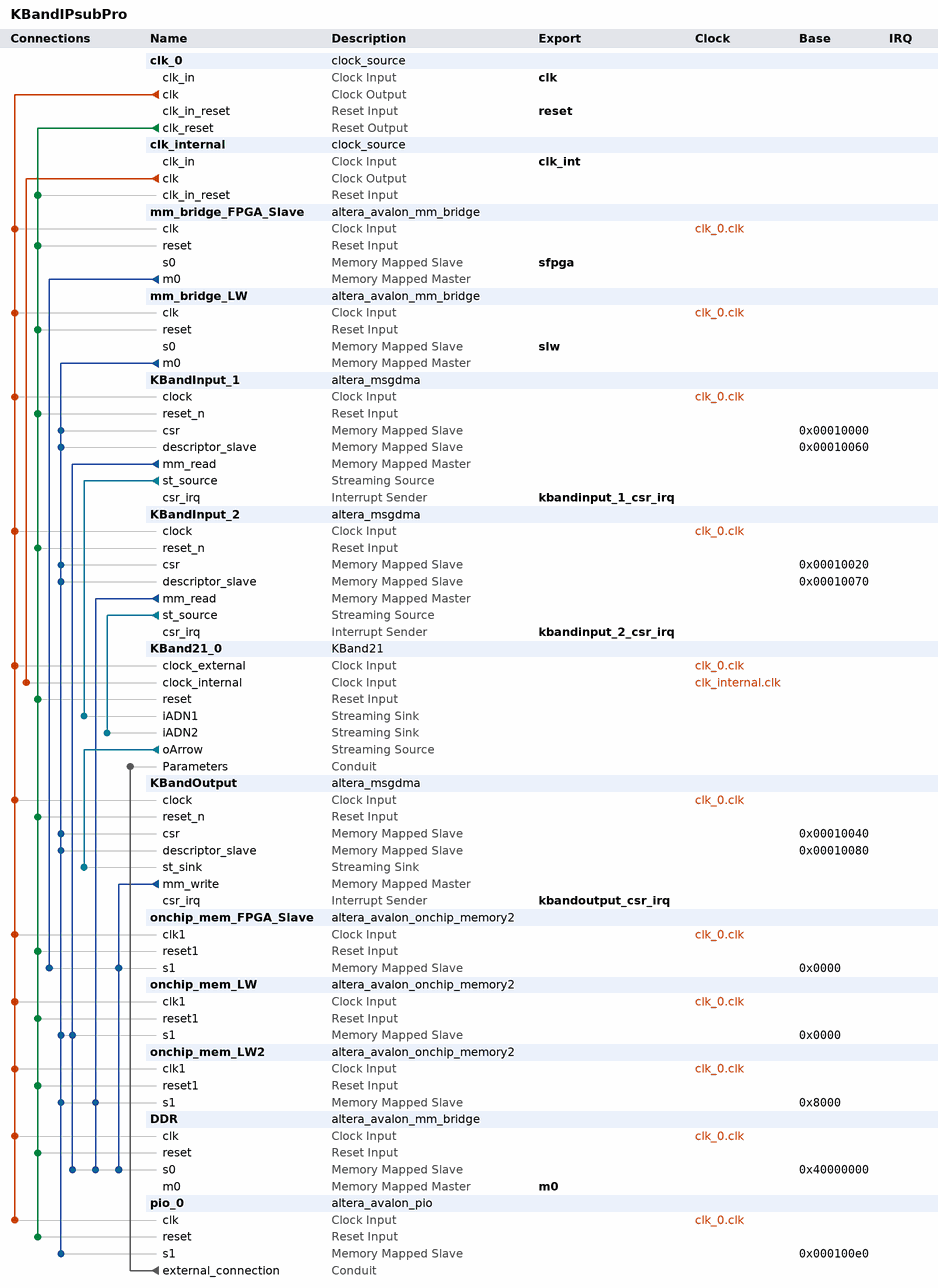
[diagram p0: system contents]
# Platform Designer (Qsys) system KBandIPsubPro, Stratix 10 1SG280HU2F50E2VG
# Parameters at their usual value, and those the tool derives, are not listed.
package require -exact qsys 1.0
create_system KBandIPsubPro
set_project_property DEVICE_FAMILY {Stratix 10}
set_project_property DEVICE 1SG280HU2F50E2VG

add_component clk_0 ip/KBandIPsubPro/KBandIPsubPro_clk_0.ip clock_source clk_0 

add_component clk_internal ip/KBandIPsubPro/KBandIPsubPro_clk_internal.ip clock_source clk_internal 

add_component mm_bridge_FPGA_Slave ip/KBandIPsubPro/KBandIPsubPro_mm_bridge_FPGA_Slave.ip altera_avalon_mm_bridge mm_bridge_FPGA_Slave 19.1
load_component mm_bridge_FPGA_Slave
set_component_parameter_value DATA_WIDTH 64
set_component_parameter_value ADDRESS_WIDTH 18
set_component_parameter_value USE_AUTO_ADDRESS_WIDTH 0
set_component_parameter_value ADDRESS_UNITS SYMBOLS
set_component_parameter_value MAX_PENDING_RESPONSES 4
set_component_parameter_value SYNC_RESET 0
save_component

add_component mm_bridge_LW ip/KBandIPsubPro/KBandIPsubPro_mm_bridge_LW.ip altera_avalon_mm_bridge mm_bridge_LW 19.1

add_component KBandInput_1 ip/KBandIPsubPro/KBandIPsubPro_KBandInput_1.ip altera_msgdma KBandInput_1 19.1

add_component KBandInput_2 ip/KBandIPsubPro/KBandIPsubPro_KBandInput_2.ip altera_msgdma KBandInput_2 19.1

add_component KBand21_0 ip/KBandIPsubPro/KBandIPsubPro_KBand21_0.ip KBand21 KBand21_0 1.0

add_component KBandOutput ip/KBandIPsubPro/KBandIPsubPro_KBandOutput.ip altera_msgdma KBandOutput 19.1
load_component KBandOutput
set_component_parameter_value MODE 2
set_component_parameter_value DATA_WIDTH 128
set_component_parameter_value DATA_FIFO_DEPTH 32
set_component_parameter_value DESCRIPTOR_FIFO_DEPTH 128
set_component_parameter_value MAX_BYTE 524288
set_component_parameter_value TRANSFER_TYPE {Aligned Accesses}
set_component_parameter_value NO_BYTEENABLES 0
set_component_parameter_value BURST_ENABLE 0
set_component_parameter_value MAX_BURST_COUNT 2
set_component_parameter_value WRITE_RESPONSE_ENABLE 0
set_component_parameter_value ENHANCED_FEATURES 0
set_component_parameter_value STRIDE_ENABLE_DERIVED 0
set_component_parameter_value PACKET_ENABLE 0
set_component_parameter_value PACKET_ENABLE_DERIVED 0
set_component_parameter_value ERROR_ENABLE 0
set_component_parameter_value ERROR_ENABLE_DERIVED 0
set_component_parameter_value CHANNEL_ENABLE_DERIVED 0
save_component

add_component onchip_mem_FPGA_Slave ip/KBandIPsubPro/KBandIPsubPro_onchip_mem_FPGA_Slave.ip altera_avalon_onchip_memory2 onchip_mem_FPGA_Slave 19.1

add_component onchip_mem_LW ip/KBandIPsubPro/KBandIPsubPro_onchip_mem_LW.ip altera_avalon_onchip_memory2 onchip_mem_LW 19.1

add_component onchip_mem_LW2 ip/KBandIPsubPro/KBandIPsubPro_onchip_mem_LW2.ip altera_avalon_onchip_memory2 onchip_mem_LW2 19.1

add_component DDR ip/KBandIPsubPro/KBandIPsubPro_DDR.ip altera_avalon_mm_bridge DDR 19.1

add_component pio_0 ip/KBandIPsubPro/KBandIPsubPro_pio_0.ip altera_avalon_pio pio_0 19.1

# connections
add_connection clk_0.clk DDR.clk clock
add_connection clk_0.clk KBand21_0.clock_external clock
add_connection clk_0.clk KBandInput_1.clock clock
add_connection clk_0.clk KBandInput_2.clock clock
add_connection clk_0.clk KBandOutput.clock clock
add_connection clk_0.clk mm_bridge_FPGA_Slave.clk clock
add_connection clk_0.clk mm_bridge_LW.clk clock
add_connection clk_0.clk onchip_mem_FPGA_Slave.clk1 clock
add_connection clk_0.clk onchip_mem_LW2.clk1 clock
add_connection clk_0.clk onchip_mem_LW.clk1 clock
add_connection clk_0.clk pio_0.clk clock
add_connection clk_internal.clk KBand21_0.clock_internal clock
add_connection clk_0.clk_reset clk_internal.clk_in_reset reset
add_connection clk_0.clk_reset DDR.reset reset
add_connection clk_0.clk_reset KBand21_0.reset reset
add_connection clk_0.clk_reset KBandInput_1.reset_n reset
add_connection clk_0.clk_reset KBandInput_2.reset_n reset
add_connection clk_0.clk_reset KBandOutput.reset_n reset
add_connection clk_0.clk_reset mm_bridge_FPGA_Slave.reset reset
add_connection clk_0.clk_reset mm_bridge_LW.reset reset
add_connection clk_0.clk_reset onchip_mem_FPGA_Slave.reset1 reset
add_connection clk_0.clk_reset onchip_mem_LW2.reset1 reset
add_connection clk_0.clk_reset onchip_mem_LW.reset1 reset
add_connection clk_0.clk_reset pio_0.reset reset
add_connection KBandInput_1.mm_read DDR.s0 avalon
set_connection_parameter_value KBandInput_1.mm_read/DDR.s0 baseAddress 0x40000000
add_connection KBandInput_1.mm_read onchip_mem_LW.s1 avalon
set_connection_parameter_value KBandInput_1.mm_read/onchip_mem_LW.s1 baseAddress 0x0000
add_connection KBandInput_2.mm_read DDR.s0 avalon
set_connection_parameter_value KBandInput_2.mm_read/DDR.s0 baseAddress 0x40000000
add_connection KBandInput_2.mm_read onchip_mem_LW2.s1 avalon
set_connection_parameter_value KBandInput_2.mm_read/onchip_mem_LW2.s1 baseAddress 0x8000
add_connection KBandOutput.mm_write DDR.s0 avalon
set_connection_parameter_value KBandOutput.mm_write/DDR.s0 baseAddress 0x40000000
add_connection KBandOutput.mm_write onchip_mem_FPGA_Slave.s1 avalon
set_connection_parameter_value KBandOutput.mm_write/onchip_mem_FPGA_Slave.s1 baseAddress 0x0000
add_connection mm_bridge_FPGA_Slave.m0 onchip_mem_FPGA_Slave.s1 avalon
set_connection_parameter_value mm_bridge_FPGA_Slave.m0/onchip_mem_FPGA_Slave.s1 baseAddress 0x0000
add_connection mm_bridge_LW.m0 KBandInput_1.csr avalon
set_connection_parameter_value mm_bridge_LW.m0/KBandInput_1.csr baseAddress 0x00010000
add_connection mm_bridge_LW.m0 KBandInput_1.descriptor_slave avalon
set_connection_parameter_value mm_bridge_LW.m0/KBandInput_1.descriptor_slave baseAddress 0x00010060
add_connection mm_bridge_LW.m0 KBandInput_2.csr avalon
set_connection_parameter_value mm_bridge_LW.m0/KBandInput_2.csr baseAddress 0x00010020
add_connection mm_bridge_LW.m0 KBandInput_2.descriptor_slave avalon
set_connection_parameter_value mm_bridge_LW.m0/KBandInput_2.descriptor_slave baseAddress 0x00010070
add_connection mm_bridge_LW.m0 KBandOutput.csr avalon
set_connection_parameter_value mm_bridge_LW.m0/KBandOutput.csr baseAddress 0x00010040
add_connection mm_bridge_LW.m0 KBandOutput.descriptor_slave avalon
set_connection_parameter_value mm_bridge_LW.m0/KBandOutput.descriptor_slave baseAddress 0x00010080
add_connection mm_bridge_LW.m0 onchip_mem_LW2.s1 avalon
set_connection_parameter_value mm_bridge_LW.m0/onchip_mem_LW2.s1 baseAddress 0x8000
add_connection mm_bridge_LW.m0 onchip_mem_LW.s1 avalon
set_connection_parameter_value mm_bridge_LW.m0/onchip_mem_LW.s1 baseAddress 0x0000
add_connection mm_bridge_LW.m0 pio_0.s1 avalon
set_connection_parameter_value mm_bridge_LW.m0/pio_0.s1 baseAddress 0x000100e0
add_connection KBand21_0.oArrow KBandOutput.st_sink avalon_streaming
add_connection KBandInput_1.st_source KBand21_0.iADN1 avalon_streaming
add_connection KBandInput_2.st_source KBand21_0.iADN2 avalon_streaming
add_connection pio_0.external_connection KBand21_0.Parameters conduit

# exported interfaces
add_interface clk clock sink
set_interface_property clk EXPORT_OF clk_0.clk_in
add_interface clk_int clock sink
set_interface_property clk_int EXPORT_OF clk_internal.clk_in
add_interface kbandinput_1_csr_irq interrupt sender
set_interface_property kbandinput_1_csr_irq EXPORT_OF KBandInput_1.csr_irq
add_interface kbandinput_2_csr_irq interrupt sender
set_interface_property kbandinput_2_csr_irq EXPORT_OF KBandInput_2.csr_irq
add_interface kbandoutput_csr_irq interrupt sender
set_interface_property kbandoutput_csr_irq EXPORT_OF KBandOutput.csr_irq
add_interface m0 avalon master
set_interface_property m0 EXPORT_OF DDR.m0
add_interface reset reset sink
set_interface_property reset EXPORT_OF clk_0.clk_in_reset
add_interface sfpga avalon slave
set_interface_property sfpga EXPORT_OF mm_bridge_FPGA_Slave.s0
add_interface slw avalon slave
set_interface_property slw EXPORT_OF mm_bridge_LW.s0

save_system KBandIPsubPro.qsys
